# EAGLE design pri_shield_leds (EAGLE 9.6.2)
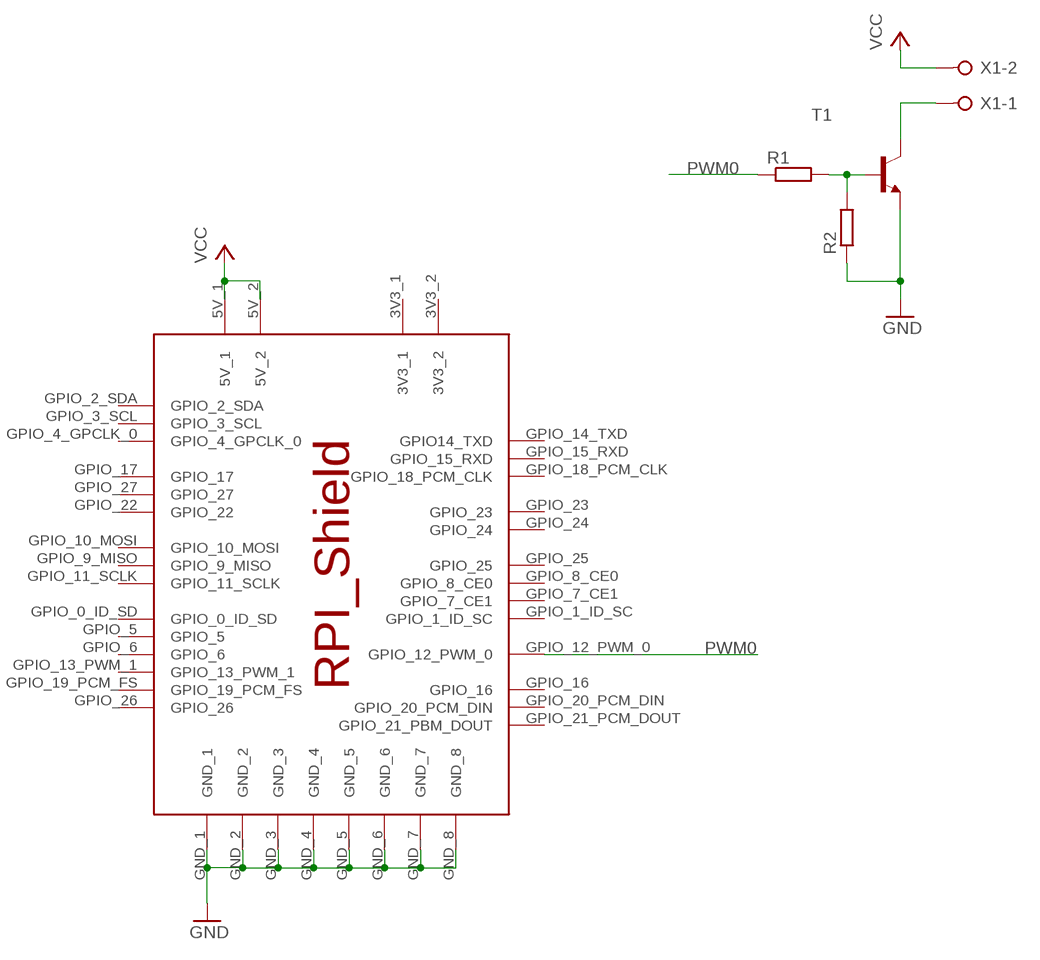
[diagram p0: schematic, sheet 1]

## Parts
R1  R-EU_R1206  [R1206]
R2  R-EU_R1206  [R1206]
T1  -NPN-SOT223  [SOT223]
U$1  RPI_SHIELD  [RPI_SHIELD]
X1  W237-02P  [W237-132]

## Nets
GND: R2.1 T1.3(E) U$1.GND_1 U$1.GND_2 U$1.GND_3 U$1.GND_4 U$1.GND_5 U$1.GND_6 U$1.GND_7 U$1.GND_8
N$1: T1.4(C) X1.1
N$3: R1.2 R2.2 T1.1(B)
PWM0: R1.1 U$1.GPIO_12_PWM_0
VCC: U$1.5V_1 U$1.5V_2 X1.2
Unconnected: U$1.3V3_1 U$1.3V3_2 U$1.GPIO_0_ID_SD U$1.GPIO_1_ID_SC U$1.GPIO_2_SDA U$1.GPIO_3_SCL U$1.GPIO_4_GPCLK_0 U$1.GPIO_5 U$1.GPIO_6 U$1.GPIO_7_CE1 U$1.GPIO_8_CE0 U$1.GPIO_9_MISO U$1.GPIO_10_MOSI U$1.GPIO_11_SCLK U$1.GPIO_13_PWM_1 U$1.GPIO_14_TXD(GPIO14_TXD) U$1.GPIO_15_RXD U$1.GPIO_16 U$1.GPIO_17 U$1.GPIO_18_PCM_CLK U$1.GPIO_19_PCM_FS U$1.GPIO_20_PCM_DIN U$1.GPIO_21_PCM_DOUT(GPIO_21_PBM_DOUT) U$1.GPIO_22 U$1.GPIO_23 U$1.GPIO_24 U$1.GPIO_25 U$1.GPIO_26 U$1.GPIO_27

## Library data of the parts
R1 R2 = rcl:R-EU_: RESISTOR, European symbol; SPICEPREFIX: R
T1 = transistor-neu-to92:*-NPN-: NPN Transistror
U$1 = rpi_shield:RPI_SHIELD
X1 = con-wago-508:W237-02P: WAGO SREW CLAMP; OC_FARNELL: unknown; OC_NEWARK: unknown

## Board
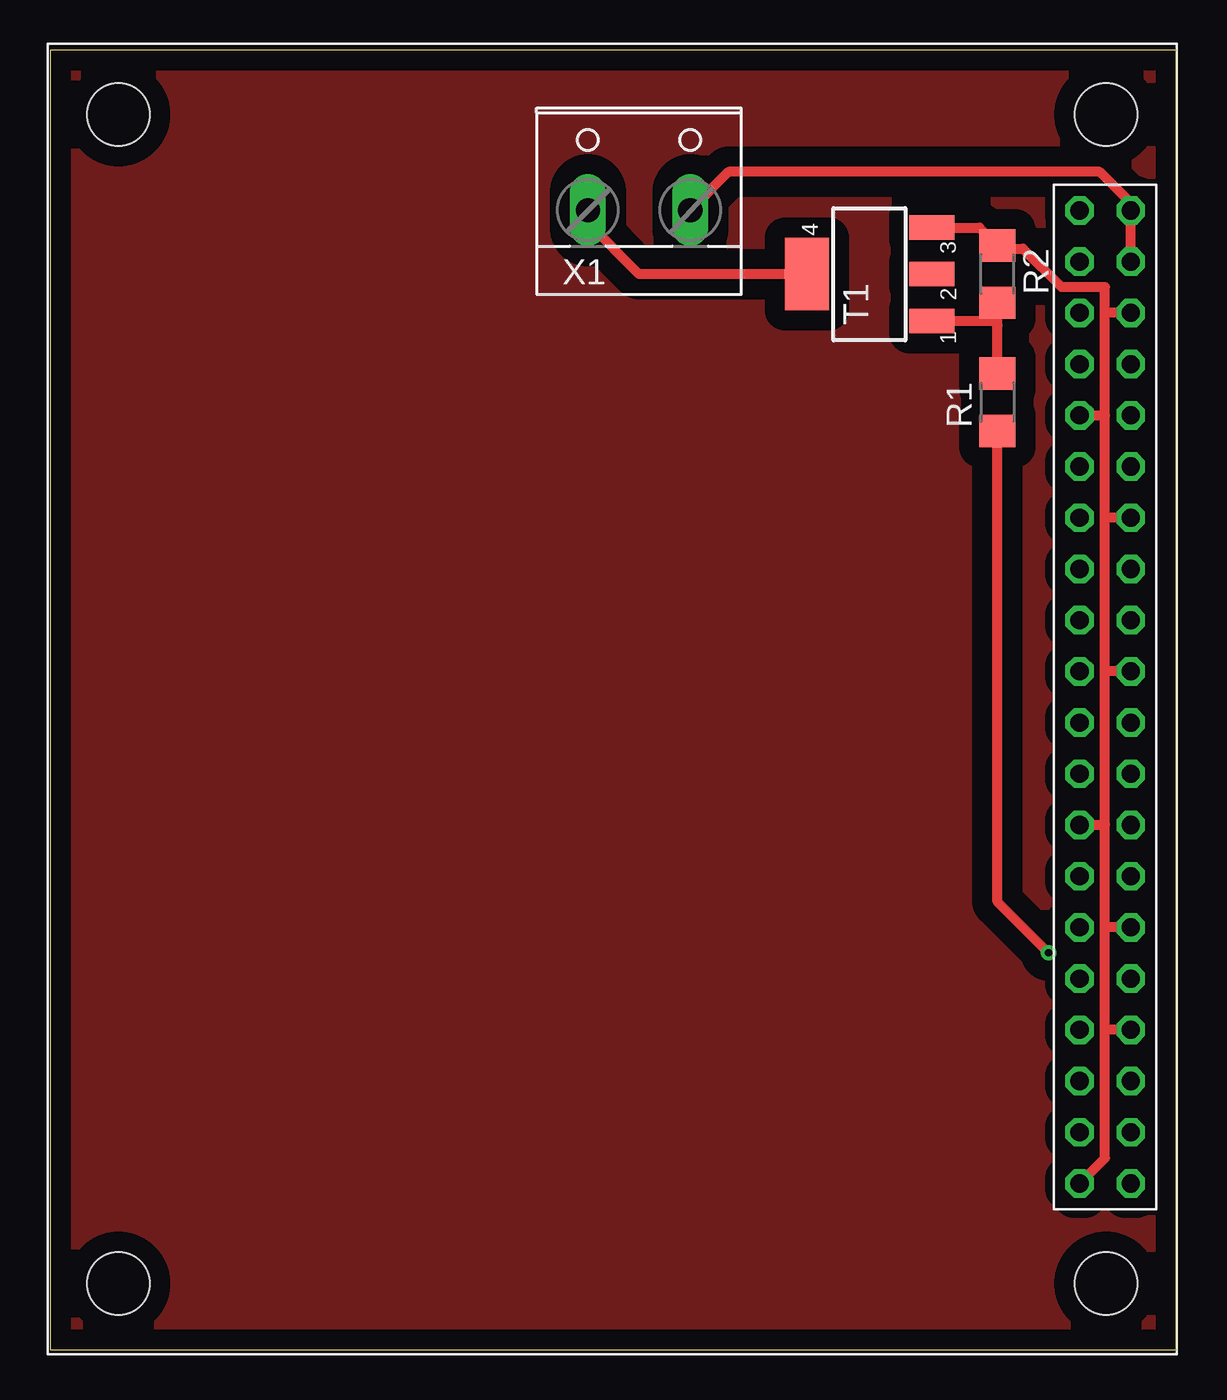
[diagram p1: board, top side]
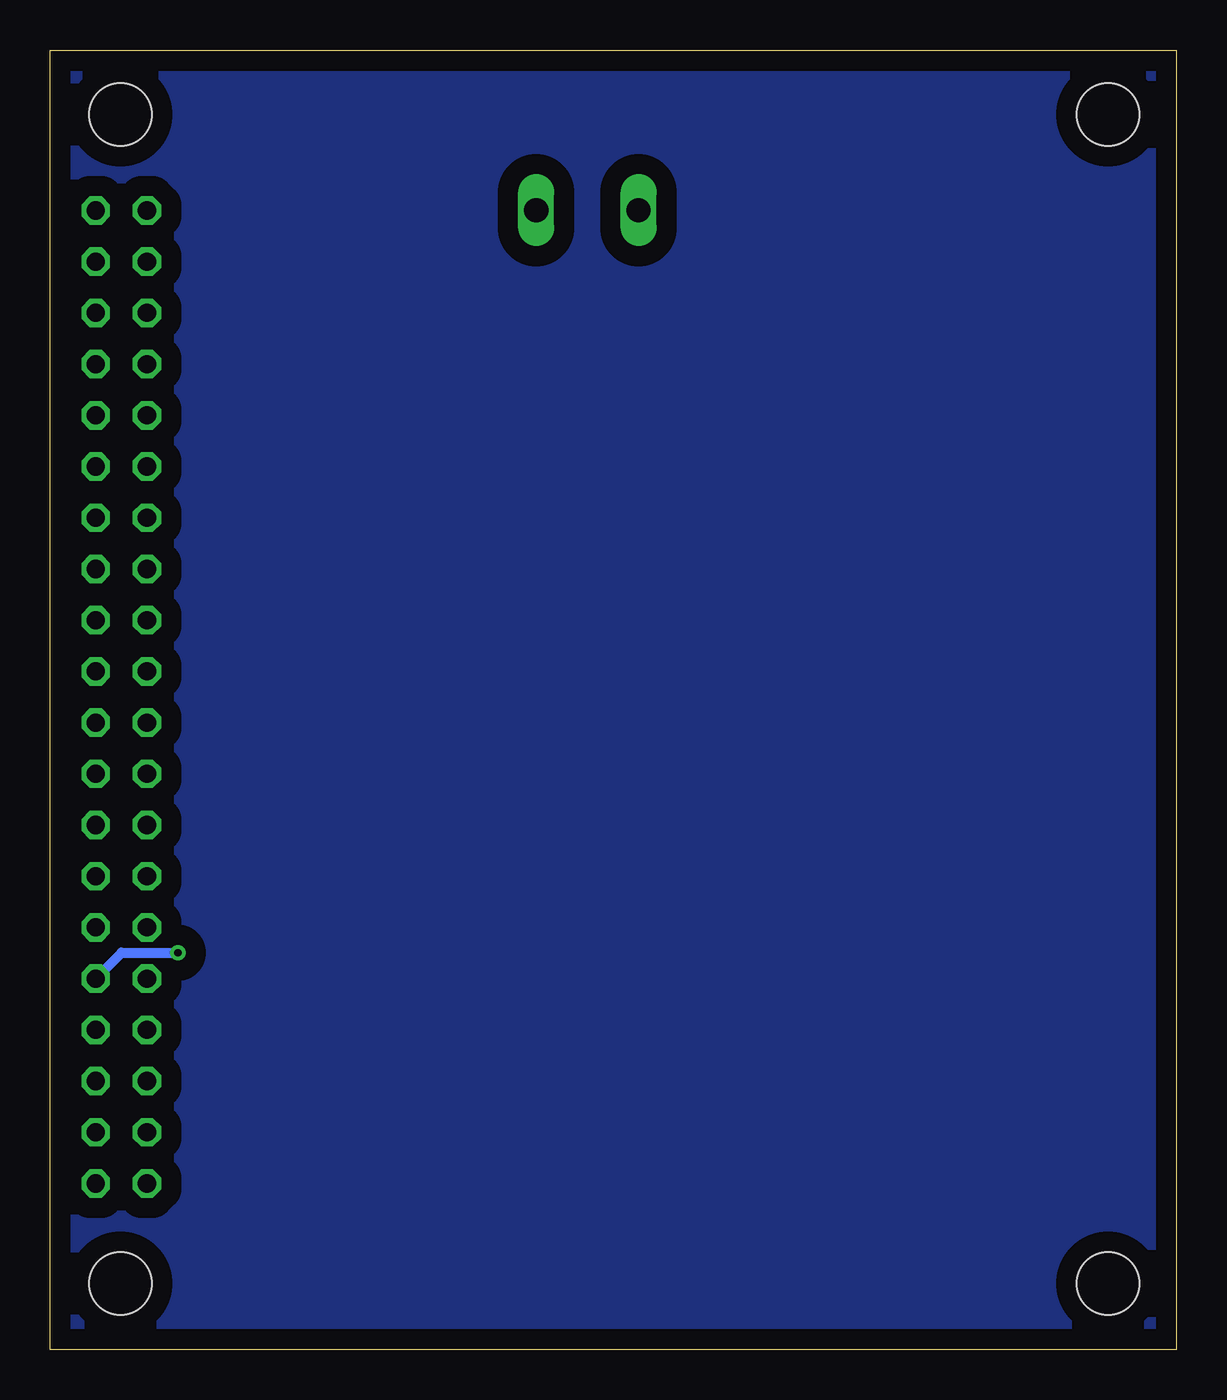
[diagram p2: board, bottom side, seen from below]

Size 55.86 x 64.44 mm. Coordinates in mm from the lower left corner, seen from the top.
Outline: 0,0 55.86,0 55.86,64.44 0,64.44 0,0
Copper layers (1*16): Top 0.035mm / dielectric 1.5mm / Bottom 0.035mm
Design rules "default": minimum track width 6mil, minimum drill 0.35mm, track to track 6mil, track to pad 6mil, pad to pad 6mil, via to via 6mil, smd to smd 6mil, copper to edge 40mil, drill to drill 6mil, minimum pad ring 10mil, minimum via ring 8mil, stop-mask expansion 4mil, vias tented up to drill 0mil, thermal gap 10mil

### Footprints (pad centres in the part's own frame; a part is rotated, then mirrored left to right if it is on the bottom)
R1206 = smd 1.6 x 1.803: 1 -1.422,0; 2 1.422,0
SOT223 = smd 1.219 x 2.235: 1 -2.311,-3.099; 2 0,-3.099; 3 2.311,-3.099 | smd 3.6 x 2.2: 4 0,3.099
RPI_SHIELD = drill 0.9 octagon: 3V3_1 51.07,36.18; 3V3_2 51.07,56.5; 5V_1 53.61,56.5; 5V_2 53.61,53.96; GND_1 53.61,51.42; GND_2 53.61,41.26; GND_3 53.61,33.64; GND_4 53.61,20.94; GND_5 53.61,15.86; GND_6 51.07,8.24; GND_7 51.07,26.02; GND_8 51.07,46.34; GPIO_0_ID_SD 51.07,23.48; GPIO_1_ID_SC 53.61,23.48; GPIO_2_SDA 51.07,53.96; GPIO_3_SCL 51.07,51.42; GPIO_4_GPCLK_0 51.07,48.88; GPIO_5 51.07,20.94; GPIO_6 51.07,18.4; GPIO_7_CE1 53.61,26.02; GPIO_8_CE0 53.61,28.56; GPIO_9_MISO 51.07,31.1; GPIO_10_MOSI 51.07,33.64; GPIO_11_SCLK 51.07,28.56; GPIO_12_PWM_0 53.61,18.4; GPIO_13_PWM_1 51.07,15.86; GPIO_14_TXD 53.61,48.88; GPIO_15_RXD 53.61,46.34; GPIO_16 53.61,13.32; GPIO_17 51.07,43.8; GPIO_18_PCM_CLK 53.61,43.8; GPIO_19_PCM_FS 51.07,13.32; GPIO_20_PCM_DIN 53.61,10.78; GPIO_21_PCM_DOUT 53.61,8.24; GPIO_22 51.07,38.72; GPIO_23 53.61,38.72; GPIO_24 53.61,36.18; GPIO_25 53.61,31.1; GPIO_26 51.07,10.78; GPIO_27 51.07,41.26 | hole 3.1: 52.38,61.27; 3.38,61.27; 3.38,3.27; 52.38,3.27
W237-132 = drill 1.194 long: 1 -2.54,-0.635; 2 2.54,-0.635

### Placement (x,y rotation side)
R1  46.99,46.99 90 top
R2  46.99,53.34 270 top
T1  40.64,53.34 90 top
U$1  0,0 0 top
X1  29.21,57.15 0 top

### Tracks (layer width: path | path; a pad name or v marks a point on that pad's centre or on a via)
GND
  Top 0.5: T1.3 46.1,55.65 R2.1 47.14,54.61 48.26,54.61 50.16,52.7 52.33,52.7 52.33,51.44 | U$1.GND_8 52.31,46.34 52.33,46.33 | 52.33,46.33 52.33,51.44 | U$1.GND_6 52.33,9.49 52.33,15.88 | 52.33,15.88 52.33,20.95 | 52.33,20.95 52.33,26.04 | 52.33,26.04 52.33,33.66 | 52.33,33.66 52.33,41.27 | 52.33,41.27 52.33,46.33 | U$1.GND_3 52.34,33.64 52.33,33.66 | U$1.GND_2 52.34,41.26 52.33,41.27 | U$1.GND_7 51.09,26.04 52.33,26.04 | U$1.GND_4 52.34,20.94 52.33,20.95 | U$1.GND_5 52.34,15.86 52.33,15.88 | U$1.GND_1 52.34,51.42 52.33,51.44
N$1
  Top 0.5: T1.4 29.21,53.34 26.67,55.88 X1.1
N$2
  pour Top (isolate 1): 0,64.77 55.88,64.77 55.88,0 0,0
N$3
  Top 0.5: R1.2 46.99,50.8 | 46.99,50.8 R2.2 | T1.1 46.76,51.03 46.99,50.8
N$4
  pour Bottom (isolate 1): 0,64.77 55.88,64.77 55.88,0 0,0
PWM0  (via drill 0.35)
  Top 0.5: v49.53,19.68 46.99,22.23 R1.1
  Bottom 0.5: U$1.GPIO_12_PWM_0 52.33,19.68 v49.53,19.68
VCC
  Top 0.5: U$1.5V_2 U$1.5V_1 53.61,56.88 52.07,58.42 33.66,58.42 X1.2